# Altium schematic sheet FPGA.SchDoc
size A4
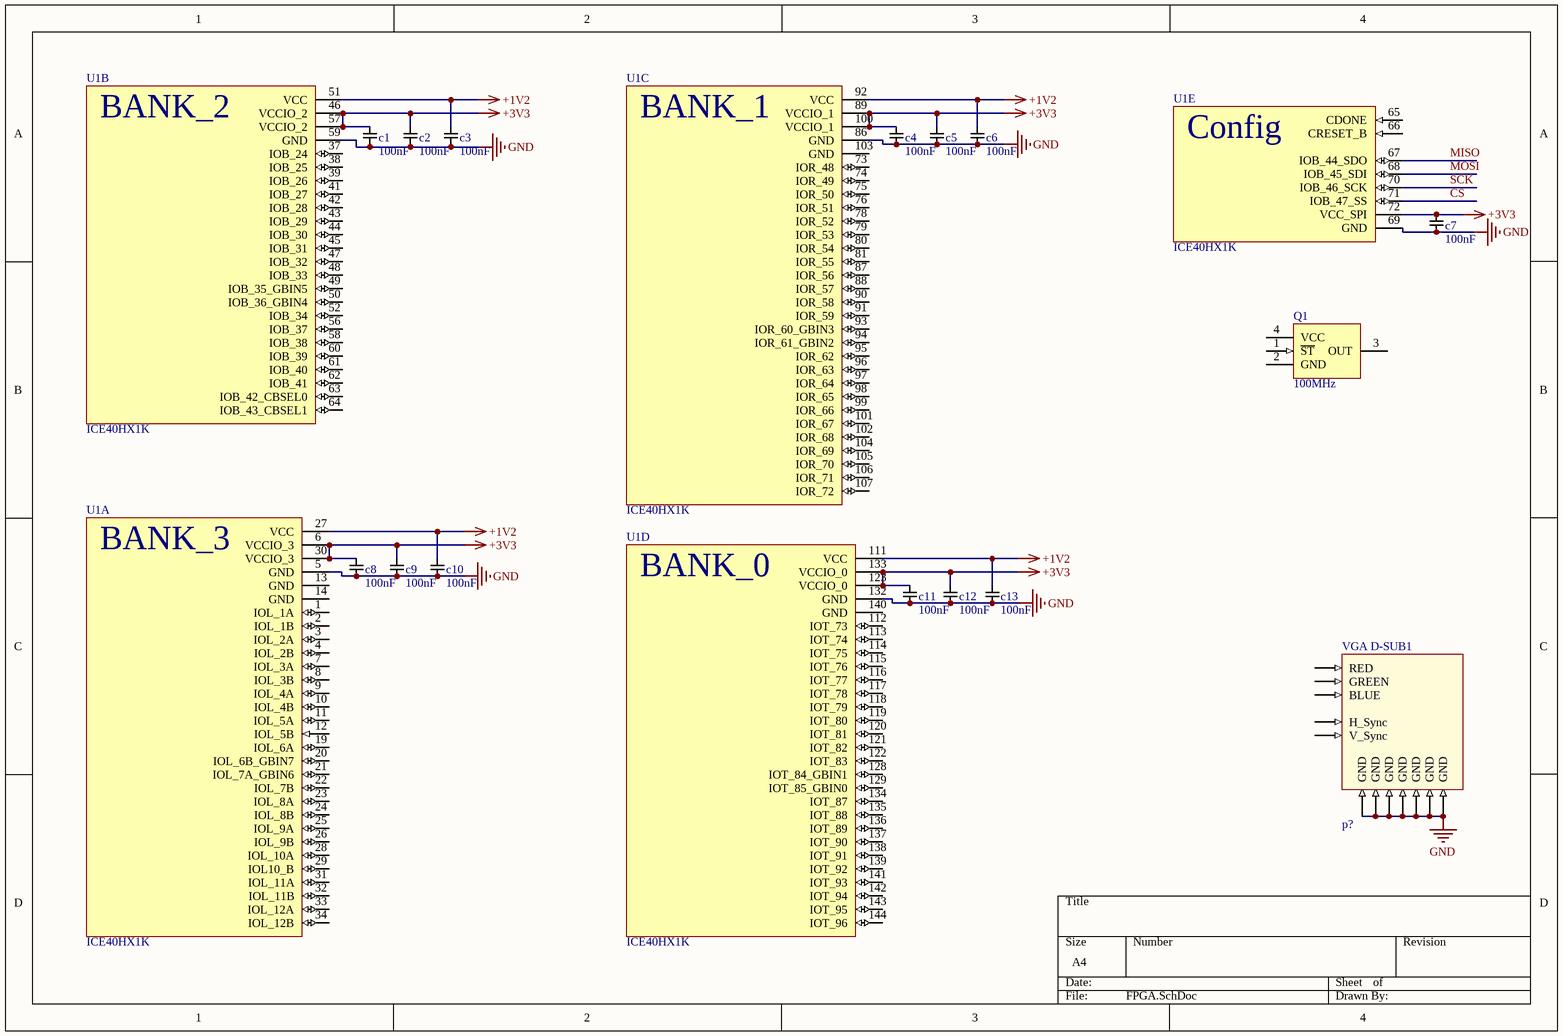
[diagram p0: FPGA.SchDoc]

## Parts
c1  100nF  [0603]
c2  100nF  [0603]
c3  100nF  [0603]
c4  100nF  [0603]
c5  100nF  [0603]
c6  100nF  [0603]
c7  100nF  [0603]
c8  100nF  [0603]
c9  100nF  [0603]
c10  100nF  [0603]
c11  100nF  [0603]
c12  100nF  [0603]
c13  100nF  [0603]
Q1  100MHz  [Crystal Oscillator-2.5X2mm]
U1  ICE40HX1K  [TQFP-144]  (parts A,B,C,D,E of 6)
VGA_D-SUB1  p?  [SUB-D15_VGA]

## Nets
+1V2: c3.2 c6.2 c10.2 c13.2 U1.27(VCC) U1.51(VCC) U1.92(VCC) U1.111(VCC)
+3V3: c1.2 c2.2 c4.2 c5.2 c7.2 c8.2 c9.2 c11.2 c12.2 U1.6(VCCIO_3) U1.30(VCCIO_3) U1.46(VCCIO_2) U1.57(VCCIO_2) U1.72(VCC_SPI) U1.89(VCCIO_1) U1.100(VCCIO_1) U1.123(VCCIO_0) U1.133(VCCIO_0)
GND: c1.1 c2.1 c3.1 c4.1 c5.1 c6.1 c7.1 c8.1 c9.1 c10.1 c11.1 c12.1 c13.1 U1.5(GND) U1.59(GND) U1.69(GND) U1.86(GND) U1.132(GND) VGA_D-SUB1.5(GND) VGA_D-SUB1.6(GND) VGA_D-SUB1.7(GND) VGA_D-SUB1.8(GND) VGA_D-SUB1.10(GND) VGA_D-SUB1.16(GND) VGA_D-SUB1.17(GND)
~{CS}: U1.71(IOB_47_SS)
MISO: U1.67(IOB_44_SDO)
MOSI: U1.68(IOB_45_SDI)
SCK: U1.70(IOB_46_SCK)

Not connected (* = marked no-connect by the designer): Q1 1(~{ST}) 2(GND) 3(OUT) 4(VCC); U1 1(IOL_1A) 2(IOL_1B) 3(IOL_2A) 4(IOL_2B) 7(IOL_3A) 8(IOL_3B) 9(IOL_4A) 10(IOL_4B) 11(IOL_5A) 12(IOL_5B) 13(GND) 14(GND) 19(IOL_6A) 20(IOL_6B_GBIN7) 21(IOL_7A_GBIN6) 22(IOL_7B) 23(IOL_8A) 24(IOL_8B) 25(IOL_9A) 26(IOL_9B) 28(IOL_10A) 29(IOL10_B) 31(IOL_11A) 32(IOL_11B) 33(IOL_12A) 34(IOL_12B) 37(IOB_24) 38(IOB_25) 39(IOB_26) 41(IOB_27) 42(IOB_28) 43(IOB_29) 44(IOB_30) 45(IOB_31) 47(IOB_32) 48(IOB_33) 49(IOB_35_GBIN5) 50(IOB_36_GBIN4) 52(IOB_34) 56(IOB_37) 58(IOB_38) 60(IOB_39) 61(IOB_40) 62(IOB_41) 63(IOB_42_CBSEL0) 64(IOB_43_CBSEL1) 65(CDONE) 66(CRESET_B) 73(IOR_48) 74(IOR_49) 75(IOR_50) 76(IOR_51) 78(IOR_52) 79(IOR_53) 80(IOR_54) 81(IOR_55) 87(IOR_56) 88(IOR_57) 90(IOR_58) 91(IOR_59) 93(IOR_60_GBIN3) 94(IOR_61_GBIN2) 95(IOR_62) 96(IOR_63) 97(IOR_64) 98(IOR_65) 99(IOR_66) 101(IOR_67) 102(IOR_68) 103(GND) 104(IOR_69) 105(IOR_70) 106(IOR_71) 107(IOR_72) 112(IOT_73) 113(IOT_74) 114(IOT_75) 115(IOT_76) 116(IOT_77) 117(IOT_78) 118(IOT_79) 119(IOT_80) 120(IOT_81) 121(IOT_82) 122(IOT_83) 128(IOT_84_GBIN1) 129(IOT_85_GBIN0) 134(IOT_87) 135(IOT_88) 136(IOT_89) 137(IOT_90) 138(IOT_91) 139(IOT_92) 140(GND) 141(IOT_93) 142(IOT_94) 143(IOT_95) 144(IOT_96); VGA_D-SUB1 1(RED) 2(GREEN) 3(BLUE) 13(H_Sync) 14(V_Sync)

## Notes on the sheet
- (in symbol ICE40HX1K, part A) BANK_3
- (in symbol ICE40HX1K, part B) BANK_2
- (in symbol ICE40HX1K, part C) BANK_1
- (in symbol ICE40HX1K, part D) BANK_0
- (in symbol ICE40HX1K, part E) Config

## Library data of the parts
c1-c13 = 0603 Capacitor: ...F
Q1 = SG-210S*H: Crystal Oscillator
U1 = ICE40HX1K: ICE40 FPGA TQFP-144
VGA_D-SUB1 = VGA connector: VGA receptor